# Altium project Plug Base.PrjPcb
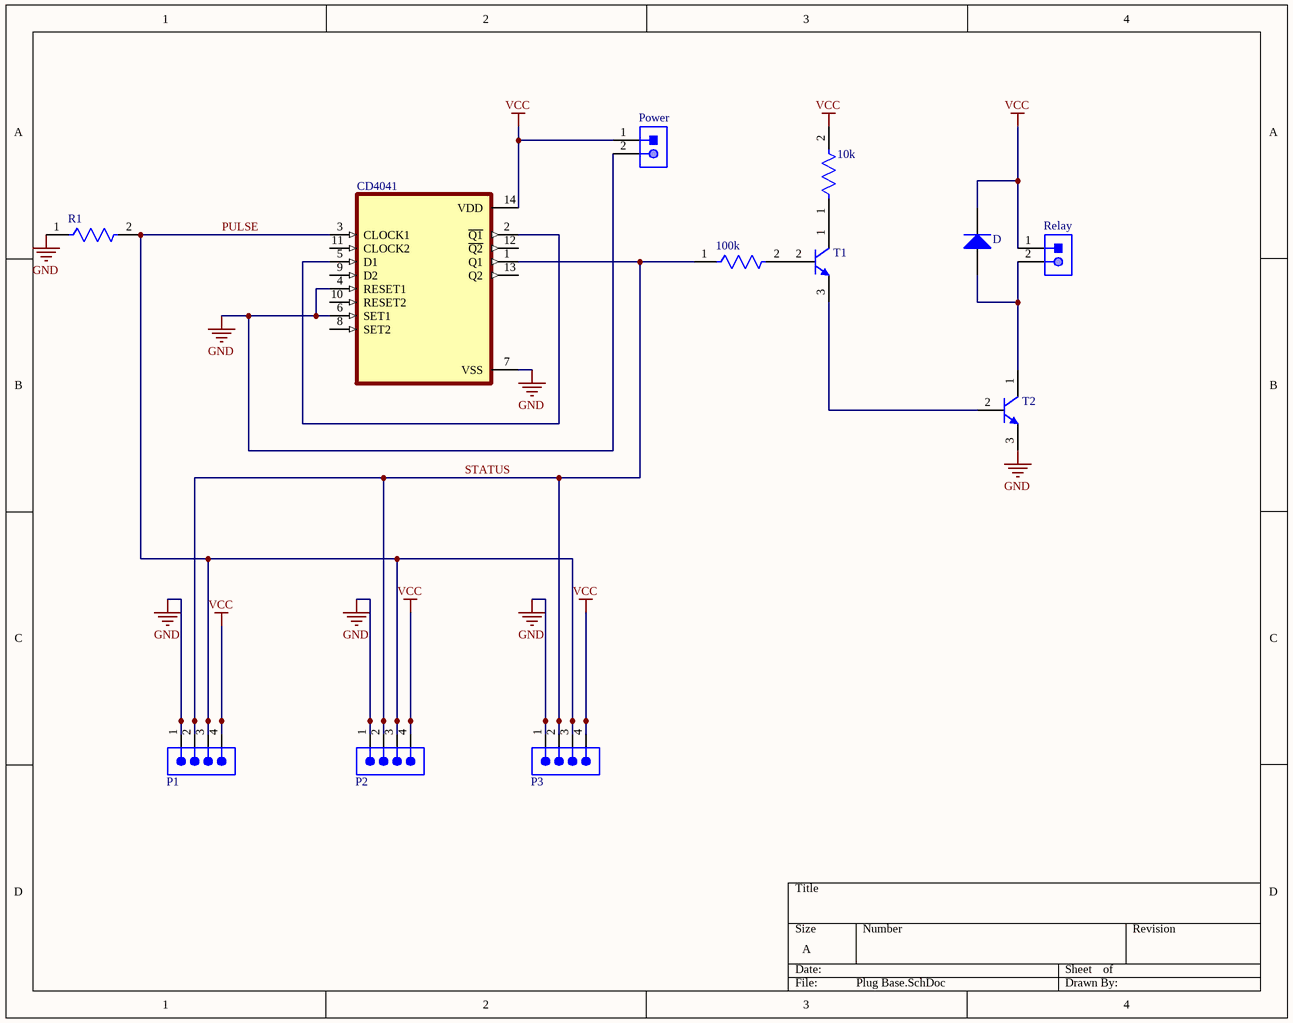
[diagram p0: Plug Base.SchDoc]
1 sheet, 12 parts. Net scope: global (net labels, ports and power ports of the same name join across sheets).
Board file: Plug Base.PcbDoc

## Sheet Plug Base.SchDoc
size A; SheetNumber: 1; SheetTotal: 1

### Parts
10k  CFR-25JB-52-10R  [FP-CFR-25-MFG]  (value not drawn)
100k  CFR-25JB-52-10R  [FP-CFR-25-MFG]  (value not drawn)
CD4041  CD4013BEE4  [DIP794W45P254L1969H508Q14]  (value not drawn)
D  1N4001-T  [DIOD-DO-41-P-2_V]  (value not drawn)
P1  TSW-104-08-L-S  [SMTC-TSW-104-08-X-S]  (value not drawn)
P2  TSW-104-08-L-S  [SMTC-TSW-104-08-X-S]  (value not drawn)
P3  TSW-104-08-L-S  [SMTC-TSW-104-08-X-S]  (value not drawn)
Power  61300211121  [61300211121]  (value not drawn)
R1  CFR-25JB-52-10R  [FP-CFR-25-MFG]  (value not drawn)
Relay  61300211121  [61300211121]  (value not drawn)
T1  BC337-25ZL1G  [ONSC-TO-92-3-29-11_AM_BL]  (value not drawn)
T2  BC337-25ZL1G  [ONSC-TO-92-3-29-11_AM_BL]  (value not drawn)

### Nets
GND: CD4041.4(RESET1) CD4041.6(SET1) CD4041.7(VSS) P1.1 P2.1 P3.1 Power.2 R1.1 T2.3(E)
VCC: 10k.2 CD4041.14(VDD) D.2(K) P1.4 P2.4 P3.4 Power.1 Relay.1
PULSE: CD4041.3(CLOCK1) P1.3 P2.3 P3.3 R1.2
STATUS: 100k.1 CD4041.1(Q1) P1.2 P2.2 P3.2
Net10k_1: 10k.1 T1.1(C)
Net100k_2: 100k.2 T1.2(B)
NetCD4041_2: CD4041.2(~{Q1}) CD4041.5(D1)
NetD_1: D.1(A) Relay.2 T2.1(C)
NetT1_3: T1.3(E) T2.2(B)

Not connected (* = marked no-connect by the designer): CD4041 8(SET2) 9(D2) 10(RESET2) 11(CLOCK2) 12(~{Q2}) 13(Q2)

### Library data of the parts
10k 100k R1 = CMP-03413-000009-1: RES 10 OHM 1/4W 5% AXIAL; Resistance: 10R; Temperature Coefficient: 500ppm/°C; Max Power Dissipation: 250mW; RoHS Compliant: Yes; Packaging: Bulk; Series: Carbon Film; Case/Package: Axial; Max Operating Temperature: 155°C; Min Operating Temperature: -55°C; Number of Terminations: 2; Length: 0.248inch; Resistor Type: Carbon Film; Tolerance: 5%; Package Quantity: 200
CD4041 = CD4013BEE4: CMOS Dual D-Type Flip Flop 14-PDIP -55 to 125; MF: Texas Instruments; Check_prices: https://www.snapeda.com/parts/CD4013BEE4/Texas+Instruments/view-part/?ref=eda; Purchase-URL: https://pricing.snapeda.com/search/part/CD4013BEE4/?ref=eda; Value: *; Availability: In Stock; Price: None; Package: PDIP-14 Texas Instruments; MP: CD4013BEE4; SnapEDA_Link: https://www.snapeda.com/parts/CD4013BEE4/Texas+Instruments/view-part/?ref=snap
D = CMP-0639-00006-2: 1.0 A Rectifier, 15 pF, 50 V, -65 to 150 degC, 2-Pin DO-41 Plastic, RoHS, Tape and Reel; Manufacturer: Diodes Inc; VF (V): 1; CT (pF): 15; Max. IR (uA): 5; VRRM (V): 50; Max. IFSM (A): 30; RoHS: TRUE; Mounting Technology: Through Hole; PartNumber: 1N4001-T; ComponentLink2Description: Datasheet; DatasheetVersion: Rev. 8-2; Operating Temperature Range (degC): -65 to 150; Packing: Tape and Reel; PackageReference: DO-41-P-2; ComponentLink1URL: http://diodes.com/; PackageDescription: 2-Pin Axial Lead, Body 4.635 x 2.36 mm, Lead Spread 25.4 mm; ComponentLink2URL: http://diodes.com/datasheets/ds28002.pdf; Max. Average Rectified Current IO (A): 1; ComponentLink1Description: Manufacturer URL
P1-P3 = CMP-1024-00358-1: 0.025" SQ Post Header, Through-hole, Vertical, -55 to 125 degC, 2.54 mm Pitch, 4-Pin, Male, RoHS; Manufacturer: Samtec; Pitch: 2.54 mm; PartNumber: TSW-104-08-L-S; RoHS: True; Temperature Range: -55 to 125 degC; PackageDescription: .025[0.64] SQ. Post Terminal Strip Assembly; Orientation: Vertical; ComponentLink2URL: http://www.samtec.com/documents/webfiles/pdf/TSW_TH.PDF; ComponentLink1Description: Manufacturer URL; ComponentLink2Description: Datasheet; PackageVersion: DM, 8/1988; ComponentLink3URL: http://www.samtec.com/documents/webfiles/cpdf/TSW-XXX-XX-XXX-X-XX-XXX-MKT.pdf; Mounting Technology: Through-hole; PackageReference: TSW-104-08-X-S; ComponentLink3Description: Package Specification; ComponentLink1URL: http://www.samtec.com; DatasheetVersion: F-214
Power Relay = CMP-1712-00002-4: THT Vertical Pin Header WR-PHD, Pitch 2.54 mm, Single Row, 2 pins; Manufacturer: Wurth Elektronik; Rated Current: 3A; Gender: Male; Withstanding Voltage: 500VAC; Working Voltage: 250VAC; Pitch: 2.54mm; Contact Resistance: 20mOhm; Pin Number: 2; Mounting Technology: THT; Orientation: Vertical; Operating Temperature: -40to105degC; Packaging: Bag; Publisher: WurthElektronik; Datasheet URL: https://katalog.we-online.de/em/datasheet/6130xx11121.pdf; Manufacturer URL: http://www.we-online.de; Row Number: Single; Package Reference: 61300211121; Part Number: 61300211121
T1 T2 = CMP-1048-01574-1: Amplifier Transistor, NPN Silicon, 3-Pin TO-92, Pb-Free, Ammo Box; Manufacturer: On Semiconductor; IC Continuous (A): 0.8; PackageDescription: 3-Pin Transistor Outline, Body 4.825 x 3.685 mm, Pitch 1.27 mm; Packing: Ammo Box; Mounting Technology: Through Hole; Polarity: NPN; ComponentLink3Description: Package Specification; DatasheetVersion: Rev. 8; PartNumber: BC337-25ZL1G; RoHS: TRUE; ComponentLink1Description: Manufacturer URL; PackageReference: TO-92-3-29-11_AM_BL; PackageVersion: Rev. AM; ComponentLink2Description: Datasheet; ComponentLink2URL: http://www.onsemi.com/pub_link/Collateral/BC337-D.PDF; ComponentLink3URL: http://www.onsemi.com/pub_link/Collateral/MAC97-D.PDF; ComponentLink1URL: http://www.onsemi.com/